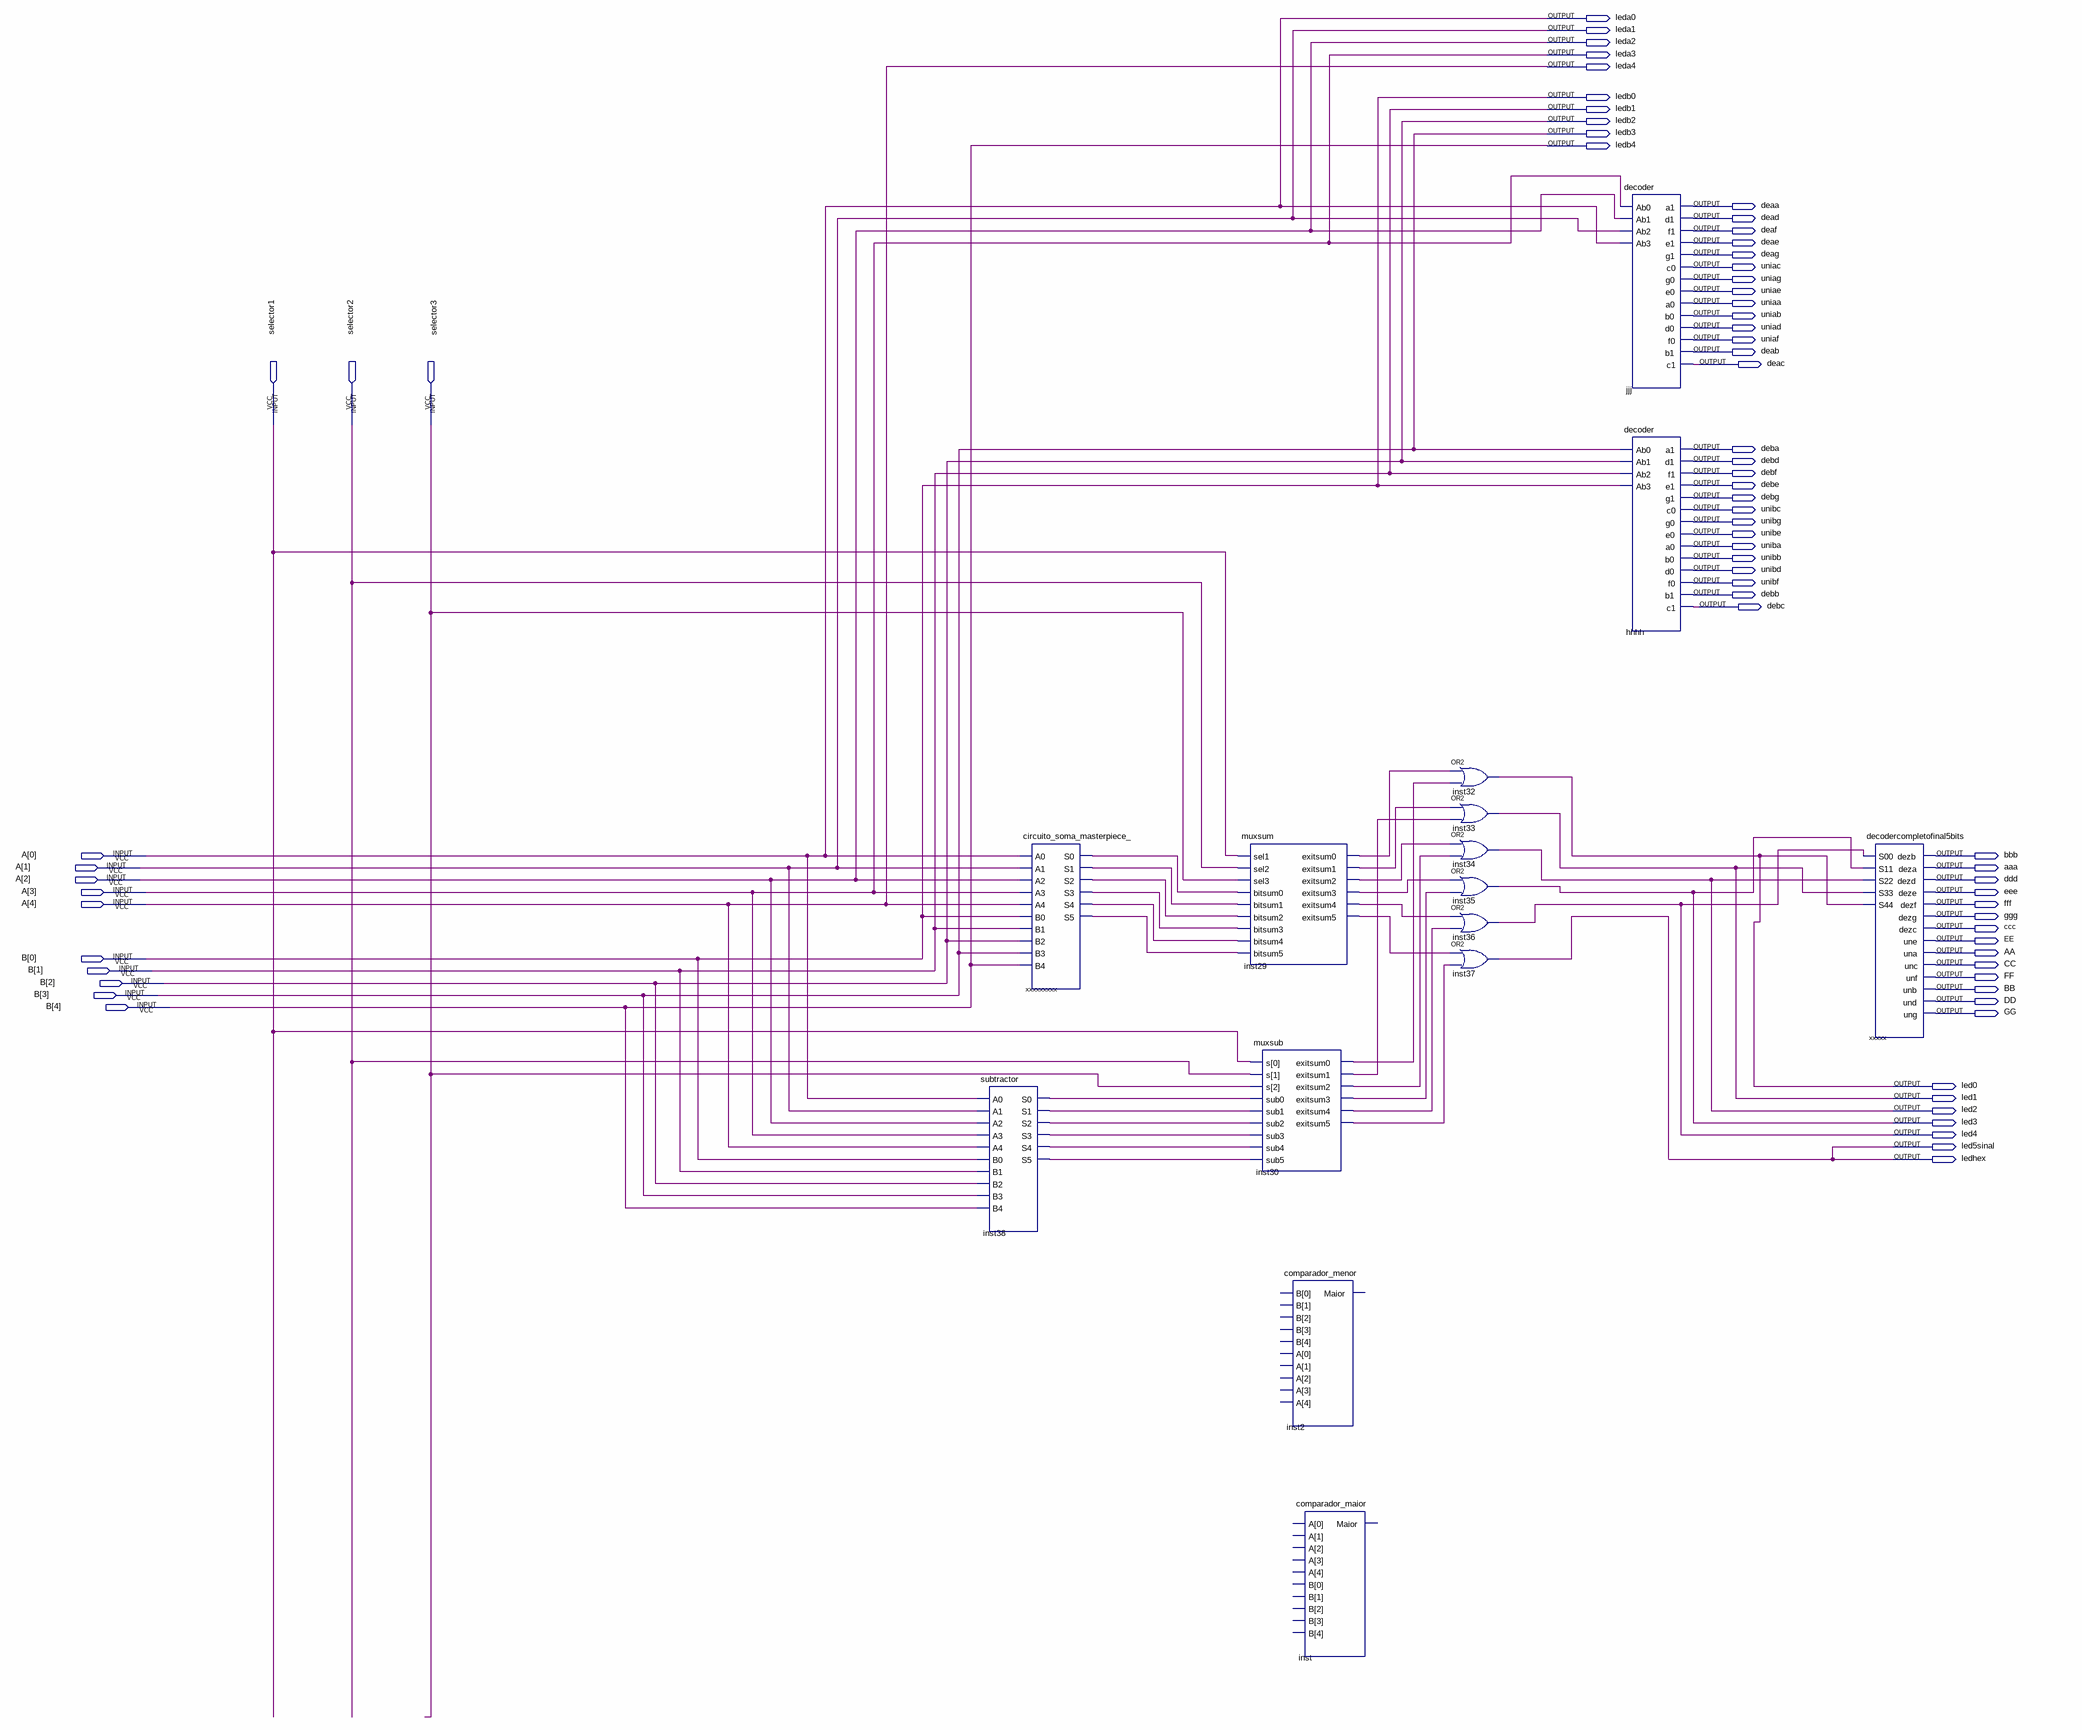
[diagram p0: schematic sheet]
// Quartus schematic circuito_completo.bdf as structural Verilog: 15 symbols, 72 pins
module circuito_completo (
  input  selector1,
  input  selector2,
  input  selector3,
  input  [4:0] A,
  input  [4:0] B,
  output leda0,
  output leda1,
  output leda2,
  output leda3,
  output leda4,
  output ledb0,
  output ledb1,
  output ledb2,
  output ledb3,
  output ledb4,
  output deaa,
  output dead,
  output deaf,
  output deae,
  output deag,
  output uniac,
  output uniag,
  output uniae,
  output uniaa,
  output uniab,
  output uniad,
  output uniaf,
  output deab,
  output deac,
  output deba,
  output debd,
  output debf,
  output debe,
  output debg,
  output unibc,
  output unibg,
  output unibe,
  output uniba,
  output unibb,
  output unibd,
  output unibf,
  output debb,
  output debc,
  output bbb,
  output aaa,
  output ddd,
  output eee,
  output fff,
  output ggg,
  output ccc,
  output EE,
  output AA,
  output CC,
  output FF,
  output BB,
  output DD,
  output GG,
  output led0,
  output led1,
  output led2,
  output led3,
  output led4,
  output led5sinal,
  output ledhex
);

  wire inst29_exitsum0, inst29_exitsum1, inst29_exitsum2, inst29_exitsum3, inst29_exitsum4, inst29_exitsum5,
       inst30_exitsum0, inst30_exitsum1, inst30_exitsum2, inst30_exitsum3, inst30_exitsum4, inst30_exitsum5,
       inst38_s0, inst38_s1, inst38_s2, inst38_s3, inst38_s4, inst38_s5, xxxxxxxxx_s0, xxxxxxxxx_s1,
       xxxxxxxxx_s2, xxxxxxxxx_s3, xxxxxxxxx_s4, xxxxxxxxx_s5;

  subtractor inst38 (
    .A0(A[0]), .A1(A[1]), .A2(A[2]), .A3(A[3]), .A4(A[4]), .B0(B[0]), .B1(B[1]), .B2(B[2]), .B3(B[3]),
    .B4(B[4]), .S0(inst38_s0), .S1(inst38_s1), .S2(inst38_s2), .S3(inst38_s3), .S4(inst38_s4), .S5(inst38_s5));
  circuito_soma_masterpiece_ xxxxxxxxx (
    .A0(A[0]), .A1(A[1]), .A2(A[2]), .A3(A[3]), .A4(A[4]), .B0(B[0]), .B1(B[1]), .B2(B[2]), .B3(B[3]),
    .B4(B[4]), .S0(xxxxxxxxx_s0), .S1(xxxxxxxxx_s1), .S2(xxxxxxxxx_s2), .S3(xxxxxxxxx_s3), .S4(xxxxxxxxx_s4),
    .S5(xxxxxxxxx_s5));
  muxsum inst29 (
    .sel1(selector1), .sel2(selector2), .sel3(selector3), .bitsum0(xxxxxxxxx_s0), .bitsum1(xxxxxxxxx_s1),
    .bitsum2(xxxxxxxxx_s2), .bitsum3(xxxxxxxxx_s3), .bitsum4(xxxxxxxxx_s4), .bitsum5(xxxxxxxxx_s5),
    .exitsum0(inst29_exitsum0), .exitsum1(inst29_exitsum1), .exitsum2(inst29_exitsum2),
    .exitsum3(inst29_exitsum3), .exitsum4(inst29_exitsum4), .exitsum5(inst29_exitsum5));
  muxsub inst30 (
    .s({selector3, selector2, selector1}), .sub0(inst38_s0), .sub1(inst38_s1), .sub2(inst38_s2),
    .sub3(inst38_s3), .sub4(inst38_s4), .sub5(inst38_s5), .exitsum0(inst30_exitsum0),
    .exitsum1(inst30_exitsum1), .exitsum2(inst30_exitsum2), .exitsum3(inst30_exitsum3),
    .exitsum4(inst30_exitsum4), .exitsum5(inst30_exitsum5));
  comparador_menor inst2 ();  // open: B, A, Maior
  comparador_maior inst ();  // open: A, B, Maior
  or inst32 (led0, inst29_exitsum0, inst30_exitsum0);
  or inst33 (led1, inst29_exitsum1, inst30_exitsum1);
  or inst34 (led2, inst29_exitsum2, inst30_exitsum2);
  or inst35 (led3, inst29_exitsum3, inst30_exitsum3);
  or inst36 (led4, inst29_exitsum4, inst30_exitsum4);
  or inst37 (led5sinal, inst29_exitsum5, inst30_exitsum5);
  decoder jjj (
    .Ab0(A[3]), .Ab1(A[2]), .Ab2(A[1]), .Ab3(A[0]), .a1(deaa), .d1(dead), .f1(deaf), .e1(deae), .g1(deag),
    .c0(uniac), .g0(uniag), .e0(uniae), .a0(uniaa), .b0(uniab), .d0(uniad), .f0(uniaf), .b1(deab), .c1(deac));
  decoder hhhh (
    .Ab0(B[3]), .Ab1(B[2]), .Ab2(B[1]), .Ab3(B[0]), .a1(deba), .d1(debd), .f1(debf), .e1(debe), .g1(debg),
    .c0(unibc), .g0(unibg), .e0(unibe), .a0(uniba), .b0(unibb), .d0(unibd), .f0(unibf), .b1(debb), .c1(debc));
  decodercompletofinal5bits xxxxx (
    .S00(led4), .S11(led3), .S22(led2), .S33(led1), .S44(led0), .dezb(bbb), .deza(aaa), .dezd(ddd),
    .deze(eee), .dezf(fff), .dezg(ggg), .dezc(ccc), .une(EE), .una(AA), .unc(CC), .unf(FF), .unb(BB),
    .und(DD), .ung(GG));

  assign leda0 = A[0];
  assign leda1 = A[1];
  assign leda2 = A[2];
  assign leda3 = A[3];
  assign leda4 = A[4];
  assign ledb0 = B[0];
  assign ledb1 = B[1];
  assign ledb2 = B[2];
  assign ledb3 = B[3];
  assign ledb4 = B[4];
  assign ledhex = led5sinal;
endmodule
